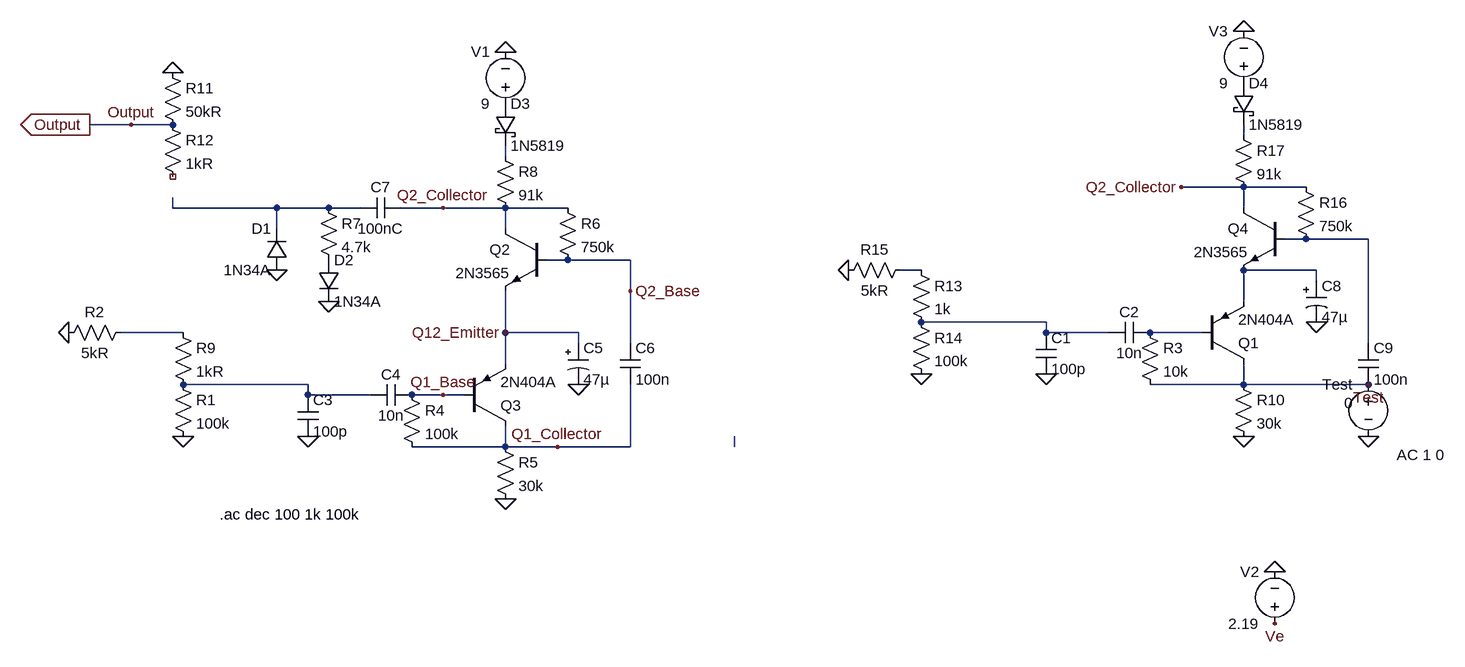
[diagram p0: schematic HarmonicPercolatorTest.asc]
HarmonicPercolatorTest.asc, the LTspice schematic file:
Version 4
SHEET 1 2472 680
WIRE 448 -528 384 -528
WIRE 512 -528 448 -528
WIRE 2160 -512 2160 -528
WIRE 1024 -480 1024 -496
WIRE 2160 -432 2064 -432
WIRE 2256 -432 2160 -432
WIRE 512 -400 512 -416
WIRE 672 -400 512 -400
WIRE 752 -400 672 -400
WIRE 800 -400 752 -400
WIRE 928 -400 864 -400
WIRE 1024 -400 928 -400
WIRE 1120 -400 1024 -400
WIRE 2160 -400 2160 -432
WIRE 672 -368 672 -400
WIRE 1024 -368 1024 -400
WIRE 2256 -352 2224 -352
WIRE 2352 -352 2256 -352
WIRE 1120 -320 1088 -320
WIRE 1216 -320 1120 -320
WIRE 1664 -304 1632 -304
WIRE 2272 -304 2160 -304
WIRE 2272 -288 2272 -304
WIRE 1216 -272 1216 -320
WIRE 2160 -256 2160 -304
WIRE 1856 -224 1664 -224
WIRE 528 -208 432 -208
WIRE 1024 -208 1024 -272
WIRE 1136 -208 1024 -208
WIRE 1856 -208 1856 -224
WIRE 1952 -208 1856 -208
WIRE 2096 -208 2016 -208
WIRE 1136 -192 1136 -208
WIRE 1216 -192 1216 -272
WIRE 2352 -192 2352 -352
WIRE 1024 -160 1024 -208
WIRE 720 -128 528 -128
WIRE 2160 -128 2160 -160
WIRE 2160 -128 2016 -128
WIRE 2352 -128 2160 -128
WIRE 720 -112 720 -128
WIRE 816 -112 720 -112
WIRE 928 -112 880 -112
WIRE 960 -112 928 -112
WIRE 1024 -32 1024 -64
WIRE 1024 -32 880 -32
WIRE 1104 -32 1024 -32
WIRE 1216 -32 1216 -128
WIRE 1216 -32 1104 -32
WIRE 1376 -32 1376 -48
FLAG 2352 -48 0
FLAG 2352 -128 Test
FLAG 720 -48 0
FLAG 1024 48 0
FLAG 1136 -128 0
FLAG 752 -256 0
FLAG 672 -304 0
FLAG 928 -112 Q1_Base
FLAG 1104 -32 Q1_Collector
FLAG 1024 -208 Q12_Emitter
FLAG 1216 -272 Q2_Base
FLAG 928 -400 Q2_Collector
FLAG 1024 -640 0
FLAG 528 -48 0
FLAG 512 -608 0
FLAG 448 -528 Output
FLAG 384 -528 Output
IOPIN 384 -528 Out
FLAG 352 -208 0
FLAG 1856 -144 0
FLAG 2160 -48 0
FLAG 2272 -224 0
FLAG 1664 -144 0
FLAG 1552 -304 0
FLAG 2208 160 0
FLAG 2208 240 Ve
FLAG 2064 -432 Q2_Collector
FLAG 2160 -672 0
SYMBOL voltage 2352 -144 M0
WINDOW 3 24 44 Left 2
WINDOW 123 -117 124 Left 2
WINDOW 39 -140 151 Left 2
SYMATTR Value 0
SYMATTR Value2 AC 1 0
SYMATTR InstName Test
SYMBOL cap 704 -112 R0
SYMATTR InstName C3
SYMATTR Value 100p
SYMBOL cap 880 -128 R90
WINDOW 0 0 32 VBottom 2
WINDOW 3 32 32 VTop 2
SYMATTR InstName C4
SYMATTR Value 10n
SYMBOL res 864 -128 R0
SYMATTR InstName R4
SYMATTR Value 100k
SYMBOL res 1008 -48 R0
SYMATTR InstName R5
SYMATTR Value 30k
SYMBOL polcap 1120 -192 R0
SYMATTR InstName C5
SYMATTR Value 47µ
SYMBOL cap 1200 -192 R0
SYMATTR InstName C6
SYMATTR Value 100n
SYMBOL res 1104 -416 R0
SYMATTR InstName R6
SYMATTR Value 750k
SYMBOL diode 688 -304 R180
WINDOW 0 24 64 Left 2
WINDOW 3 24 0 Left 2
SYMATTR InstName D1
SYMATTR Value 1N34A
SYMBOL res 736 -416 R0
SYMATTR InstName R7
SYMATTR Value 4.7k
SYMBOL diode 736 -320 R0
SYMATTR InstName D2
SYMATTR Value 1N34A
SYMBOL res 1008 -496 R0
SYMATTR InstName R8
SYMATTR Value 91k
SYMBOL npn 1088 -368 M0
SYMATTR InstName Q2
SYMATTR Value 2N3565
SYMBOL schottky 1008 -560 R0
SYMATTR InstName D3
SYMATTR Value 1N5819
SYMATTR Description Diode
SYMATTR Type diode
SYMBOL pnp 960 -64 M180
SYMATTR InstName Q3
SYMATTR Value 2N404A
SYMBOL cap 864 -416 R90
WINDOW 0 0 32 VBottom 2
WINDOW 3 32 32 VTop 2
SYMATTR InstName C7
SYMATTR Value 100nC
SYMBOL res 512 -224 R0
SYMATTR InstName R9
SYMATTR Value 1kR
SYMBOL res 496 -624 R0
SYMATTR InstName R11
SYMATTR Value 50kR
SYMBOL res 496 -544 R0
SYMATTR InstName R12
SYMATTR Value 1kR
SYMBOL voltage 1024 -544 R180
WINDOW 0 24 96 Left 2
WINDOW 3 24 16 Left 2
WINDOW 123 0 0 Left 0
WINDOW 39 0 0 Left 0
SYMATTR InstName V1
SYMATTR Value 9
SYMBOL res 512 -144 R0
SYMATTR InstName R1
SYMATTR Value 100k
SYMBOL res 448 -224 R90
WINDOW 0 0 56 VBottom 2
WINDOW 3 32 56 VTop 2
SYMATTR InstName R2
SYMATTR Value 5kR
SYMBOL cap 1840 -208 R0
SYMATTR InstName C1
SYMATTR Value 100p
SYMBOL cap 2016 -224 R90
WINDOW 0 0 32 VBottom 2
WINDOW 3 32 32 VTop 2
SYMATTR InstName C2
SYMATTR Value 10n
SYMBOL res 2000 -224 R0
SYMATTR InstName R3
SYMATTR Value 10k
SYMBOL res 2144 -144 R0
SYMATTR InstName R10
SYMATTR Value 30k
SYMBOL polcap 2256 -288 R0
SYMATTR InstName C8
SYMATTR Value 47µ
SYMBOL pnp 2096 -160 M180
SYMATTR InstName Q1
SYMATTR Value 2N404A
SYMBOL res 1648 -320 R0
SYMATTR InstName R13
SYMATTR Value 1k
SYMBOL res 1648 -240 R0
SYMATTR InstName R14
SYMATTR Value 100k
SYMBOL res 1648 -320 R90
WINDOW 0 0 56 VBottom 2
WINDOW 3 32 56 VTop 2
SYMATTR InstName R15
SYMATTR Value 5kR
SYMBOL voltage 2208 256 R180
WINDOW 0 24 96 Left 2
WINDOW 3 24 16 Left 2
WINDOW 123 0 0 Left 0
WINDOW 39 0 0 Left 0
SYMATTR InstName V2
SYMATTR Value 2.19
SYMBOL res 2240 -448 R0
SYMATTR InstName R16
SYMATTR Value 750k
SYMBOL res 2144 -528 R0
SYMATTR InstName R17
SYMATTR Value 91k
SYMBOL npn 2224 -400 M0
SYMATTR InstName Q4
SYMATTR Value 2N3565
SYMBOL schottky 2144 -592 R0
SYMATTR InstName D4
SYMATTR Value 1N5819
SYMATTR Description Diode
SYMATTR Type diode
SYMBOL voltage 2160 -576 R180
WINDOW 0 24 96 Left 2
WINDOW 3 24 16 Left 2
WINDOW 123 0 0 Left 0
WINDOW 39 0 0 Left 0
SYMATTR InstName V3
SYMATTR Value 9
SYMBOL cap 2336 -192 R0
SYMATTR InstName C9
SYMATTR Value 100n
TEXT 584 72 Left 2 !.ac dec 100 1k 100k

The netlist it stands for:
* HarmonicPercolatorTest.asc
V§Test Test 0 0 AC 1 0
C3 N010 0 100p
C4 Q1_Base N010 10n
R4 Q1_Base Q1_Collector 100k
R5 Q1_Collector 0 30k
C5 Q12_Emitter 0 47µ
C6 Q2_Base Q1_Collector 100n
R6 Q2_Collector Q2_Base 750k
D1 0 N003 1N34A
R7 N003 P001 4.7k
D2 P001 0 1N34A
R8 N002 Q2_Collector 91k
Q2 Q2_Collector Q2_Base Q12_Emitter 0 2N3565
D3 P002 N002 1N5819
Q3 Q1_Collector Q1_Base Q12_Emitter 0 2N404A
C7 Q2_Collector N003 100nC
R9 N008 N010 1kR
R11 0 Output 50kR
R12 Output NC_01 1kR
V1 P002 0 9
R1 N010 0 100k
R2 N008 0 5kR
C1 N007 0 100p
C2 N009 N007 10n
R3 N009 Test 10k
R10 Test 0 30k
C8 N006 0 47µ
Q1 Test N009 N006 0 2N404A
R13 N005 N007 1k
R14 N007 0 100k
R15 N005 0 5kR
V2 Ve 0 2.19
R16 Q2_Collector N004 750k
R17 N001 Q2_Collector 91k
Q4 Q2_Collector N004 N006 0 2N3565
D4 P003 N001 1N5819
V3 P003 0 9
C9 N004 Test 100n
.model D D
.lib standard.dio
.model NPN NPN
.model PNP PNP
.lib standard.bjt
.ac dec 100 1k 100k
.backanno
.end